# EAGLE design PRTF02 (EAGLE 6.6.0)
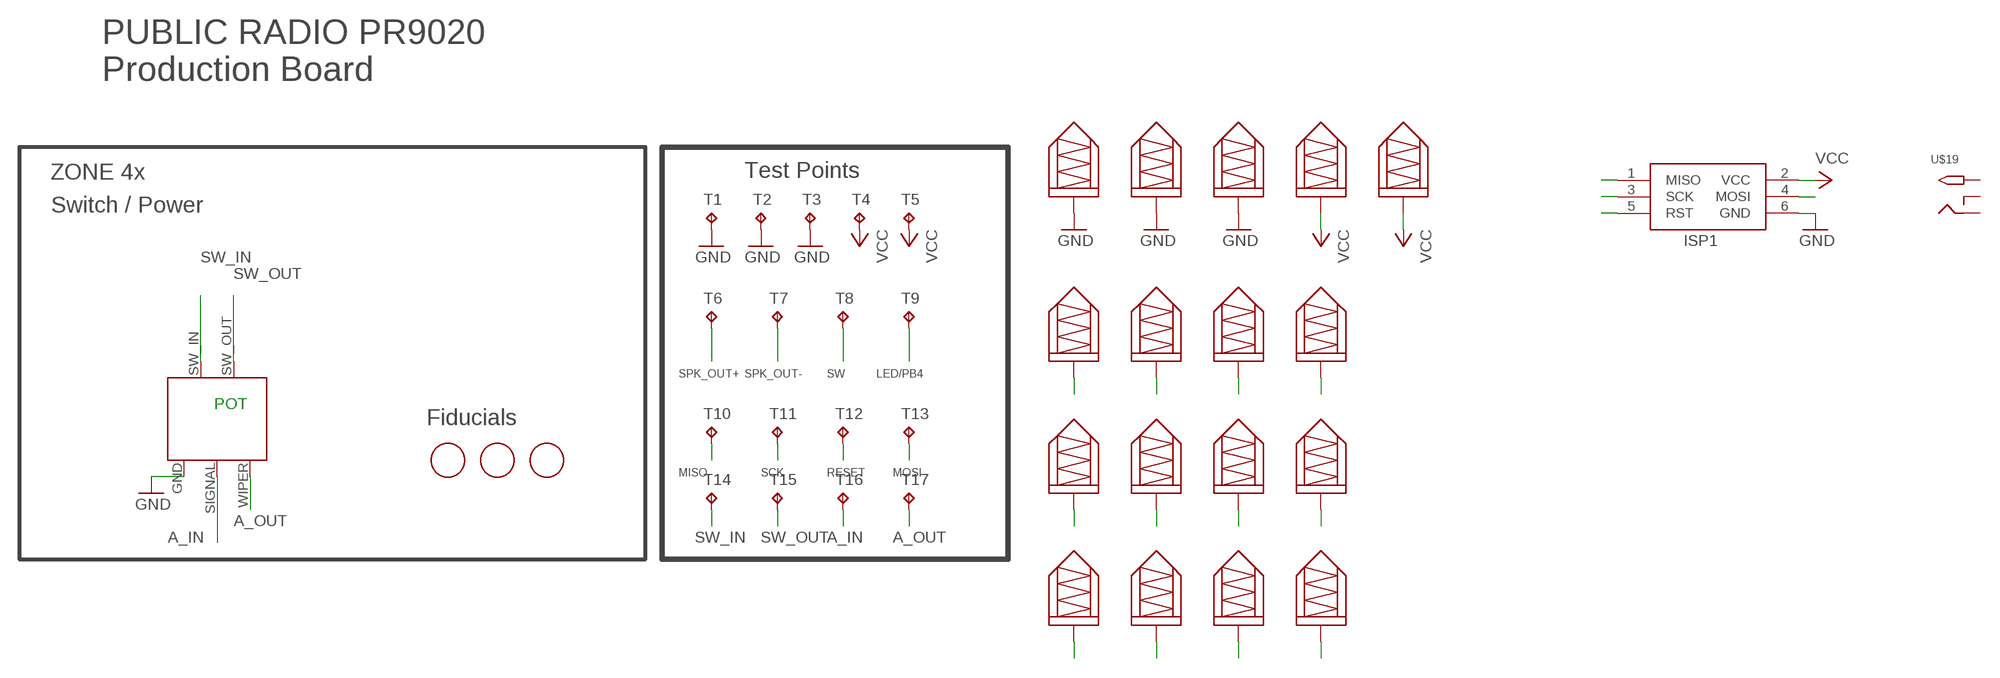
[diagram p0: schematic, sheet 1]

## Parts
ISP1  AVRISP-6  [AVRISP]
MARK1  FIDUCIAL  [FIDUCIAL_1MM]
MARK2  FIDUCIAL  [FIDUCIAL_1MM]
MARK3  FIDUCIAL  [FIDUCIAL_1MM]
R1  RV170SF_TAIWANA_POT_SW  [RV170SF_SW_POT]
T1  TPTP20R  [TP20R]
T2  TPTP20R  [TP20R]
T3  TPTP20R  [TP20R]
T4  TPTP20R  [TP20R]
T5  TPTP20R  [TP20R]
T6  TPTP20R  [TP20R]
T7  TPTP20R  [TP20R]
T8  TPTP20R  [TP20R]
T9  TPTP20R  [TP20R]
T10  TPTP20R  [TP20R]
T11  TPTP20R  [TP20R]
T12  TPTP20R  [TP20R]
T13  TPTP20R  [TP20R]
T14  TPTP20R  [TP20R]
T15  TPTP20R  [TP20R]
T16  TPTP20R  [TP20R]
T17  TPTP20R  [TP20R]
U$2  0908MILL_MAX_SPRINGPIN  [0908MILL_MAX_SPRINGPIN]
U$3  0908MILL_MAX_SPRINGPIN  [0908MILL_MAX_SPRINGPIN]
U$4  0908MILL_MAX_SPRINGPIN  [0908MILL_MAX_SPRINGPIN]
U$5  0908MILL_MAX_SPRINGPIN  [0908MILL_MAX_SPRINGPIN]
U$6  0908MILL_MAX_SPRINGPIN  [0908MILL_MAX_SPRINGPIN]
U$7  0908MILL_MAX_SPRINGPIN  [0908MILL_MAX_SPRINGPIN]
U$8  0908MILL_MAX_SPRINGPIN  [0908MILL_MAX_SPRINGPIN]
U$9  0908MILL_MAX_SPRINGPIN  [0908MILL_MAX_SPRINGPIN]
U$10  0908MILL_MAX_SPRINGPIN  [0908MILL_MAX_SPRINGPIN]
U$11  0908MILL_MAX_SPRINGPIN  [0908MILL_MAX_SPRINGPIN]
U$12  0908MILL_MAX_SPRINGPIN  [0908MILL_MAX_SPRINGPIN]
U$13  0908MILL_MAX_SPRINGPIN  [0908MILL_MAX_SPRINGPIN]
U$14  0908MILL_MAX_SPRINGPIN  [0908MILL_MAX_SPRINGPIN]
U$15  0908MILL_MAX_SPRINGPIN  [0908MILL_MAX_SPRINGPIN]
U$16  0908MILL_MAX_SPRINGPIN  [0908MILL_MAX_SPRINGPIN]
U$17  0908MILL_MAX_SPRINGPIN  [0908MILL_MAX_SPRINGPIN]
U$18  0908MILL_MAX_SPRINGPIN  [0908MILL_MAX_SPRINGPIN]
U$19  2.1MMJACKTHM  [PJ-102A]

## Nets
!RST: T10.TP
A_IN: R1.SIGNAL T16.TP U$17.P$1
A_OUT: R1.WIPER T17.TP U$18.P$1
GND: ISP1.6(GND) R1.GND T1.TP T2.TP T3.TP U$2.P$1 U$3.P$1 U$4.P$1
LED/PB4: T9.TP U$10.P$1
MISO: ISP1.1(MISO) U$11.P$1
MOSI: ISP1.4(MOSI) U$14.P$1
RESET: T12.TP U$13.P$1
RST: ISP1.5(RST)
SCK: ISP1.3(SCK) U$12.P$1
SCLK: T11.TP
SDIO: T13.TP
SPK_OUT+: T6.TP U$7.P$1
SPK_OUT-: T7.TP U$8.P$1
SW: T8.TP U$9.P$1
SW_IN: R1.SW_IN T14.TP U$15.P$1
SW_OUT: R1.SW_OUT T15.TP U$16.P$1
VCC: ISP1.2(VCC) T4.TP T5.TP U$5.P$1 U$6.P$1
Unconnected: U$19.RING U$19.RING_SW U$19.TIP

## Notes on the sheet
- PUBLIC RADIO PR9020
  Production Board
- ZONE 4x | Test Points
- Switch / Power
- POT
- Fiducials
- MISO | SCK | RESET | MOSI

## Library data of the parts
ISP1 = adafruit:AVRISP: AVR ISP HEADER Standard 6 pin header for AVR programming
MARK1-MARK3 = PR_Parts_Library:FIDUCIAL: 1mm fiducial.; MFG_PN: DNP
R1 = PR_Parts_Library:RV170SF_TAIWANA_POT_SW: Thru hole switched potentiometer.; MFG_PN: RV170SF-43-20F-A10K - supplied by CL Labs
T1-T17 = PR_Parts_Library:TP: Test pad; MFG_PN: DNP
U$2-U$18 = PR_Parts_Library:0908MILL_MAX_SPRINGPIN: MFG# 0908-1-15-20-75-14-11-0; MFG#: 0908-1-15-20-75-14-11-0
U$19 = adafruit:2.1MMJACK: 2.1mm x 5.5mm THM DC jack with internal switch. Digikey part #PJ-102A, 4UCON part #05537 2.1mm x 5.5mm SMT DC jack with internal switch. Digikey part #PJ-002A-SMT, 4UCON part #03267 By microbuilder.eu & adafruit.com

## Net classes
1 antenna: clearance 1.27 mm

## Board
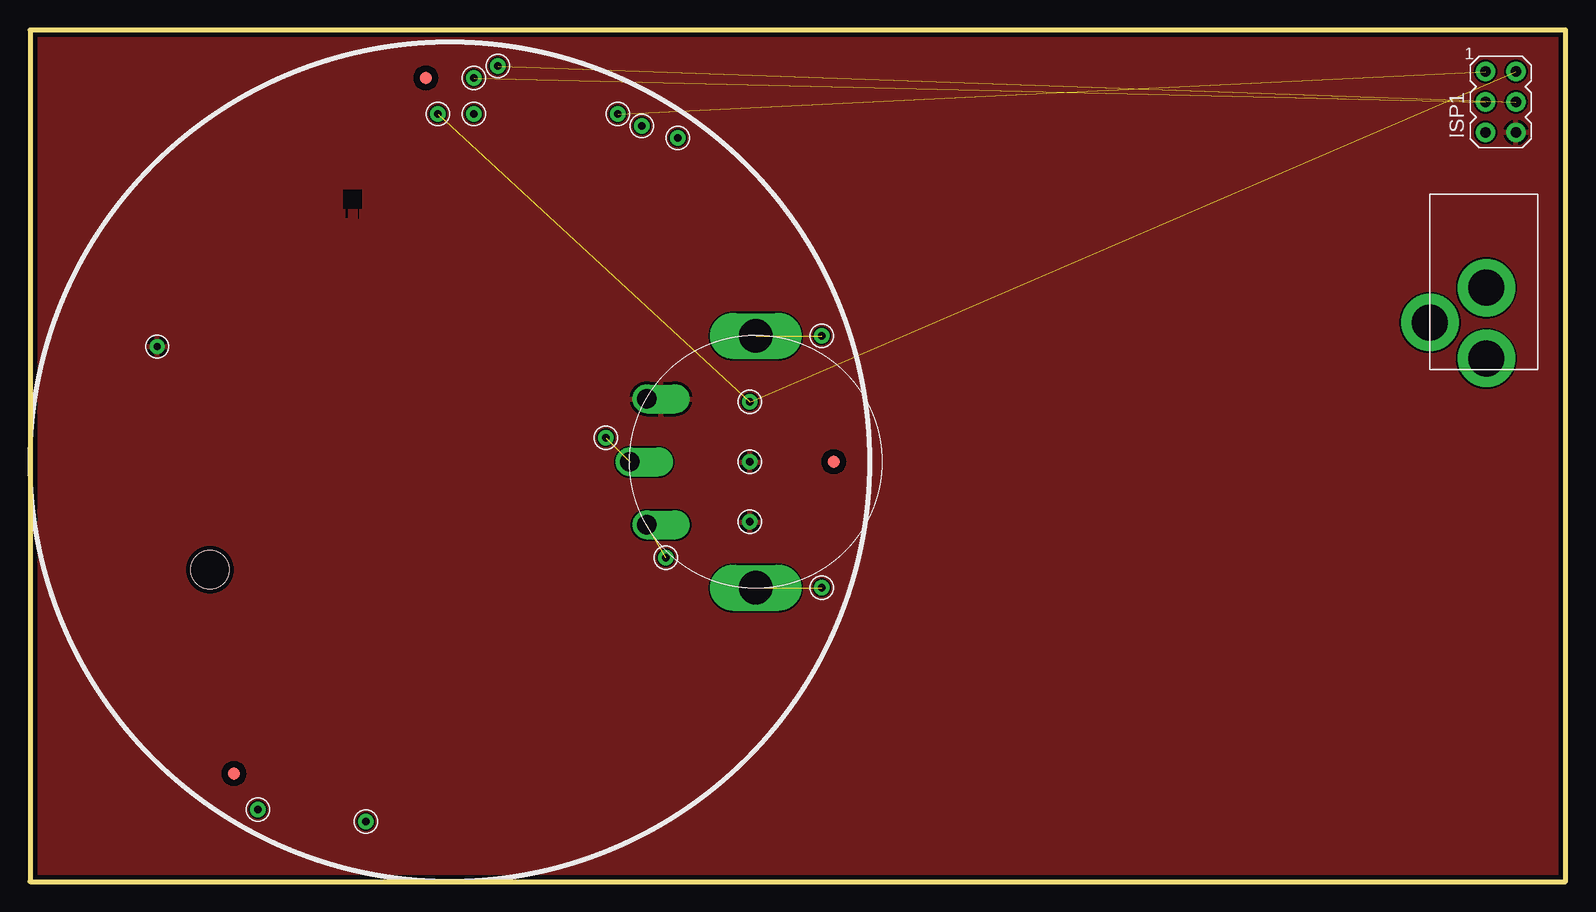
[diagram p1: board, top side]
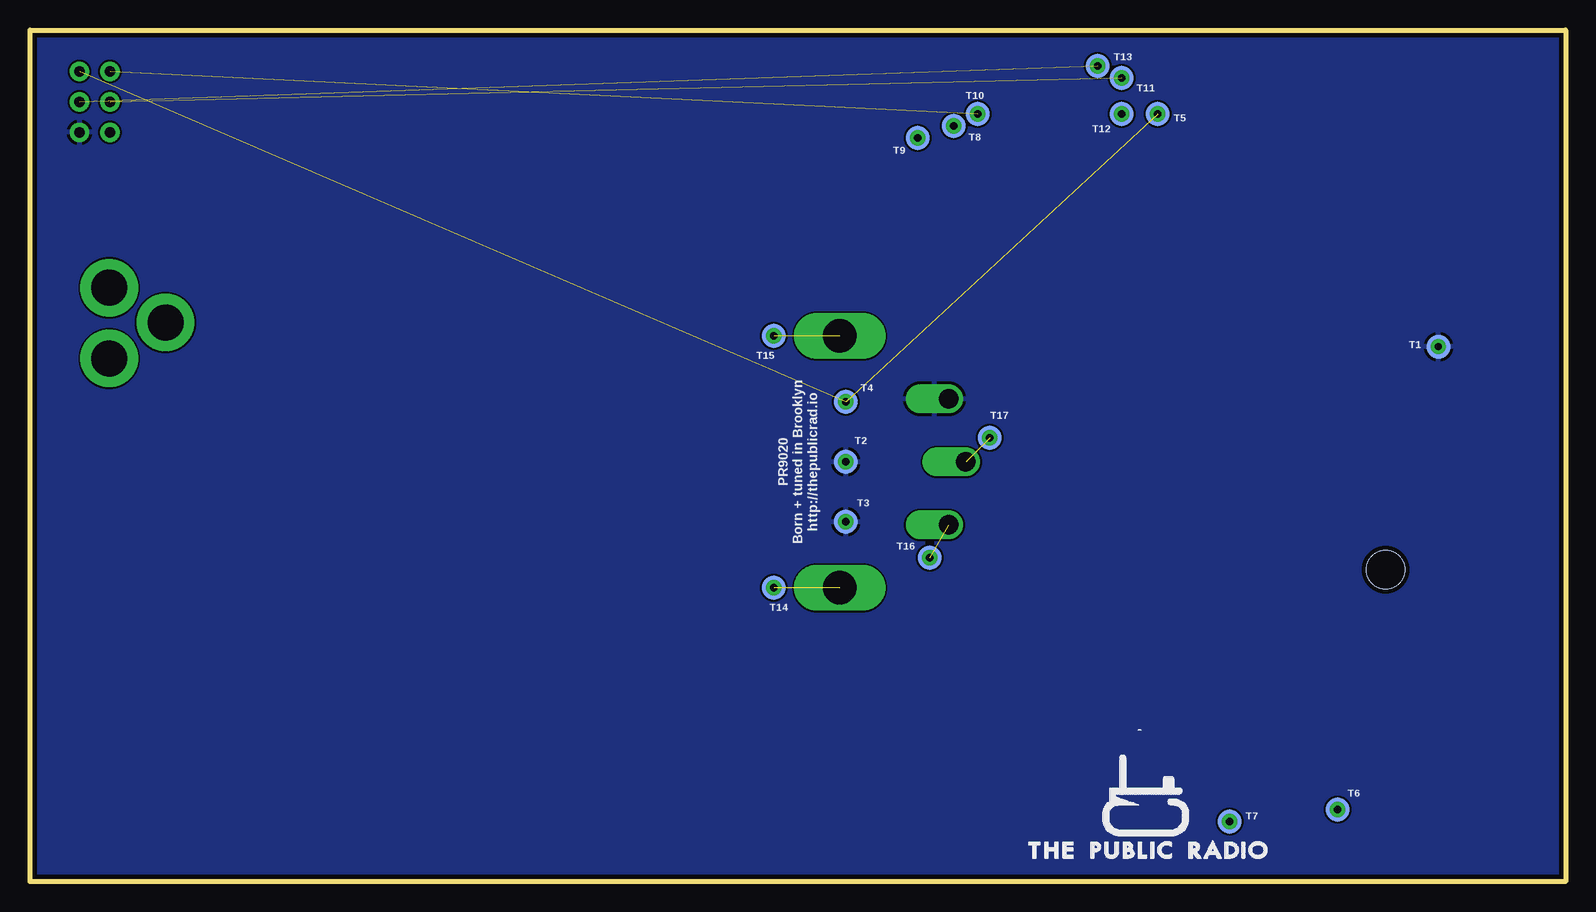
[diagram p2: board, bottom side, seen from below]

Size 128 x 71 mm. Coordinates in mm from the lower left corner, seen from the top.
Outline: 0,0 128,0 128,71 0,71 0,0
Copper layers (1*16): Top 0.0356mm / dielectric 1.5011mm / Bottom 0.0356mm
Design rules "LaenPCBOrder *": minimum track width 6mil, minimum drill 13mil, track to track 6mil, track to pad 6mil, pad to pad 6mil, via to via 6mil, smd to smd 6mil, copper to edge 15mil, drill to drill 6mil, minimum pad ring 7mil, minimum via ring 5mil, stop-mask expansion 3mil, vias tented up to drill 0mil, thermal gap 10mil
Holes 3.2 mm at 15,26
tRestrict: area 26.1,56.1 to 27.7,57.7; 8 lines

### Footprints (pad centres in the part's own frame; a part is rotated, then mirrored left to right if it is on the bottom)
AVRISP = drill 0.9 pad 1.626: 1 -1.27,2.54; 2 1.27,2.54; 3 -1.27,0; 4 1.27,0; 5 -1.27,-2.54; 6 1.27,-2.54
FIDUCIAL_1MM = smd 1 x 1: 1 0,0
RV170SF_SW_POT = drill 1.6 offset: GND -5.25,-9.09; SIGNAL 5.25,-9.09; WIPER 0,-10.5 | drill 2.8 long: SW_IN 10.5,0; SW_OUT -10.5,0
TP20R = smd 2 x 2: TP 0,0
0908MILL_MAX_SPRINGPIN = drill 0.6 pad 1.27: P$1 0,0
PJ-102A = drill 3 pad 4.8: RING 0.1,-3.39; RING_SW -4.6,-6.29; TIP 0.1,-9.29

### Placement (x,y rotation side)
ISP1  122.6,65 0 top
MARK1  17,9 0 top
MARK2  33,67 0 top
MARK3  67,35 0 top
R1  60.5,35 270 top
T1  10.6,44.6 0 bottom
T2  60,35 0 bottom
T3  60,30 0 bottom
T4  60,40 0 bottom
T5  34,64 0 bottom
T6  19,6 0 bottom
T7  28,5 0 bottom
T8  51,63 0 bottom
T9  54,62 0 bottom
T10  49,64 0 bottom
T11  37,67 0 bottom
T12  37,64 0 bottom
T13  39,68 0 bottom
T14  66,24.5 0 bottom
T15  66,45.5 0 bottom
T16  53,27 0 bottom
T17  48,37 0 bottom
U$1  [PR_LOGO]  35,7.5 0 bottom
U$2  10.6,44.6 0 top
U$3  60,35 0 top
U$4  60,30 0 top
U$5  60,40 0 top
U$6  34,64 0 top
U$7  19,6 0 top
U$8  28,5 0 top
U$9  51,63 0 top
U$10  54,62 0 top
U$11  49,64 0 top
U$12  37,67 0 top
U$13  37,64 0 top
U$14  39,68 0 top
U$15  66,24.5 0 top
U$16  66,45.5 0 top
U$17  53,27 0 top
U$18  48,37 0 top
U$19  121.3,52.9 0 top

### Tracks (layer width: path | path; a pad name or v marks a point on that pad's centre or on a via)
A_IN  (1 unrouted)
A_OUT  (1 unrouted)
GND
  pour Top: 0,71 128,71 128,0 0,0 0,70
  pour Bottom: 0,0 128,0 128,71 0,71
MISO  (1 unrouted)
MOSI  (1 unrouted)
N$21
  pour Bottom: 
SCK  (1 unrouted)
SW_IN  (1 unrouted)
SW_OUT  (1 unrouted)
VCC  (2 unrouted)

### Text on the board
bNames: PR9020 / Born + tuned in Brooklyn / http://thepublicrad.io